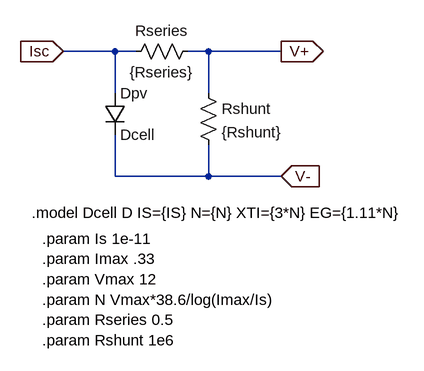
[diagram p0: schematic SolarCell.asc]
SolarCell.asc, the LTspice schematic file:
Version 4
SHEET 1 1020 680
WIRE 304 112 224 112
WIRE 336 112 304 112
WIRE 448 112 416 112
WIRE 560 112 448 112
WIRE 304 176 304 112
WIRE 448 176 448 112
WIRE 304 304 304 240
WIRE 448 304 448 256
WIRE 448 304 304 304
WIRE 560 304 448 304
FLAG 224 112 Isc
IOPIN 224 112 In
FLAG 560 112 V+
IOPIN 560 112 Out
FLAG 560 304 V-
IOPIN 560 304 In
SYMBOL diode 288 176 R0
SYMATTR InstName Dpv
SYMATTR Value Dcell
SYMBOL res 432 160 R0
SYMATTR InstName Rshunt
SYMATTR Value {Rshunt}
SYMBOL res 432 96 R90
WINDOW 0 0 56 VBottom 2
WINDOW 3 32 56 VTop 2
SYMATTR InstName Rseries
SYMATTR Value {Rseries}
TEXT 176 360 Left 2 !.model Dcell D IS={IS} N={N} XTI={3*N} EG={1.11*N}
TEXT 192 400 Left 2 !.param Is 1e-11\n.param Imax .33\n.param Vmax 12\n.param N Vmax*38.6/log(Imax/Is)\n.param Rseries 0.5\n.param Rshunt 1e6

The netlist it stands for:
* SolarCell.asc
Dpv Isc V- Dcell
Rshunt V+ V- {Rshunt}
Rseries V+ Isc {Rseries}
.model D D
.lib standard.dio
.model Dcell D IS={IS} N={N} XTI={3*N} EG={1.11*N}
.param Is 1e-11
.param Imax .33
.param Vmax 12
.param N Vmax*38.6/log(Imax/Is)
.param Rseries 0.5
.param Rshunt 1e6
.backanno
.end